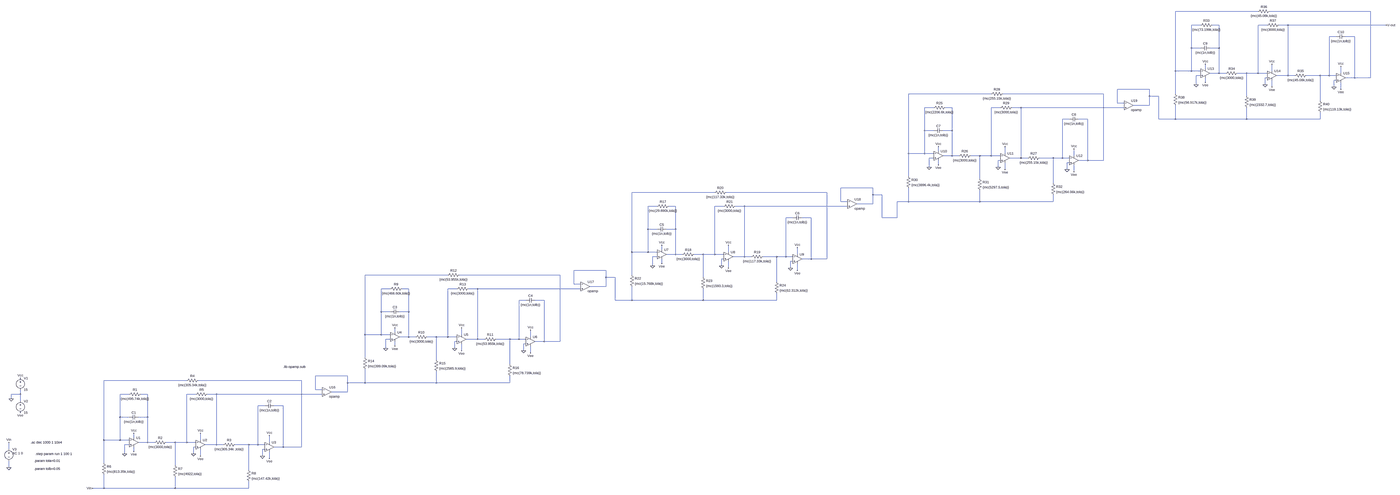
[diagram p0: schematic Todas las etapas.asc, whole sheet]
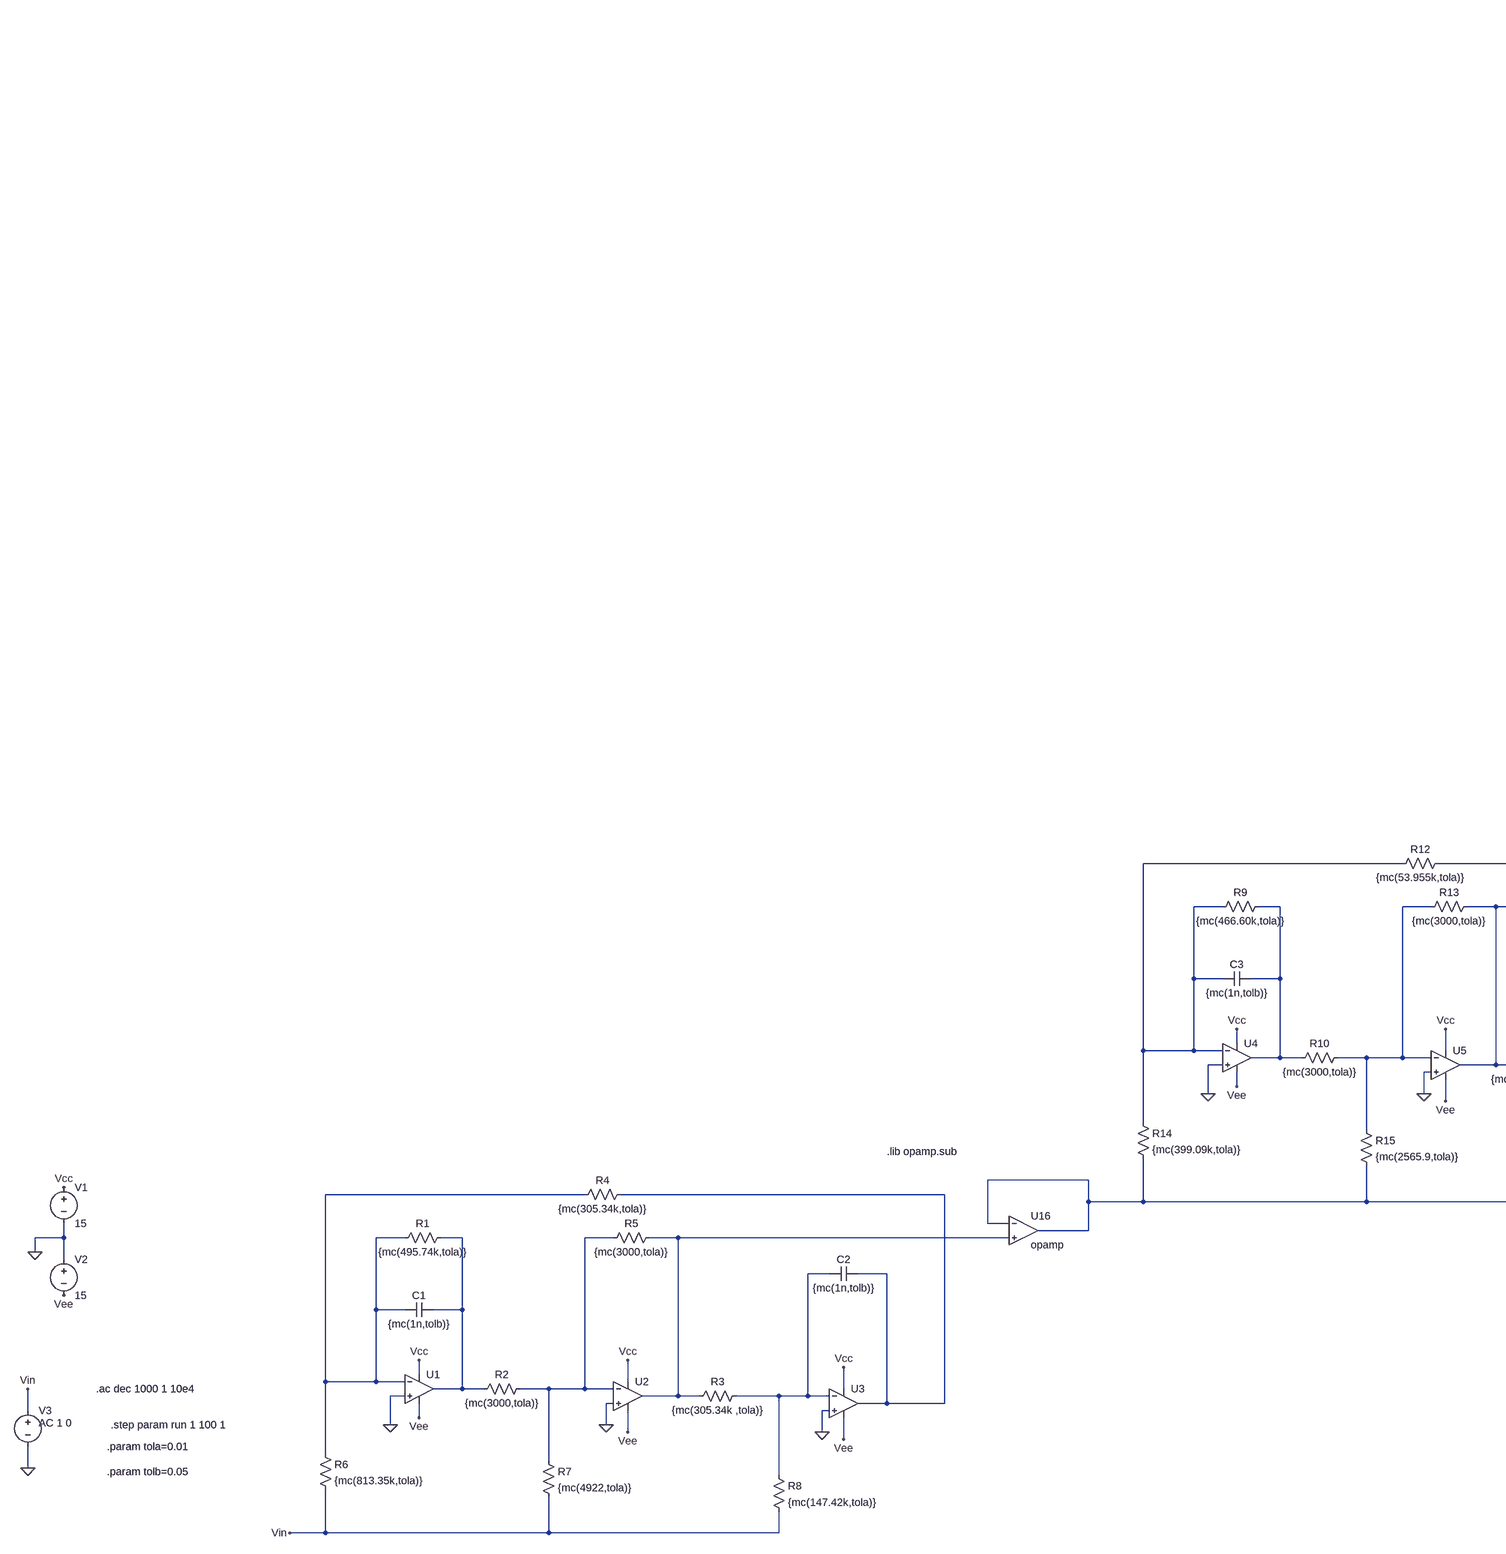
[diagram p1: schematic Todas las etapas.asc, part, row 1 of 1, column 1 of 3]
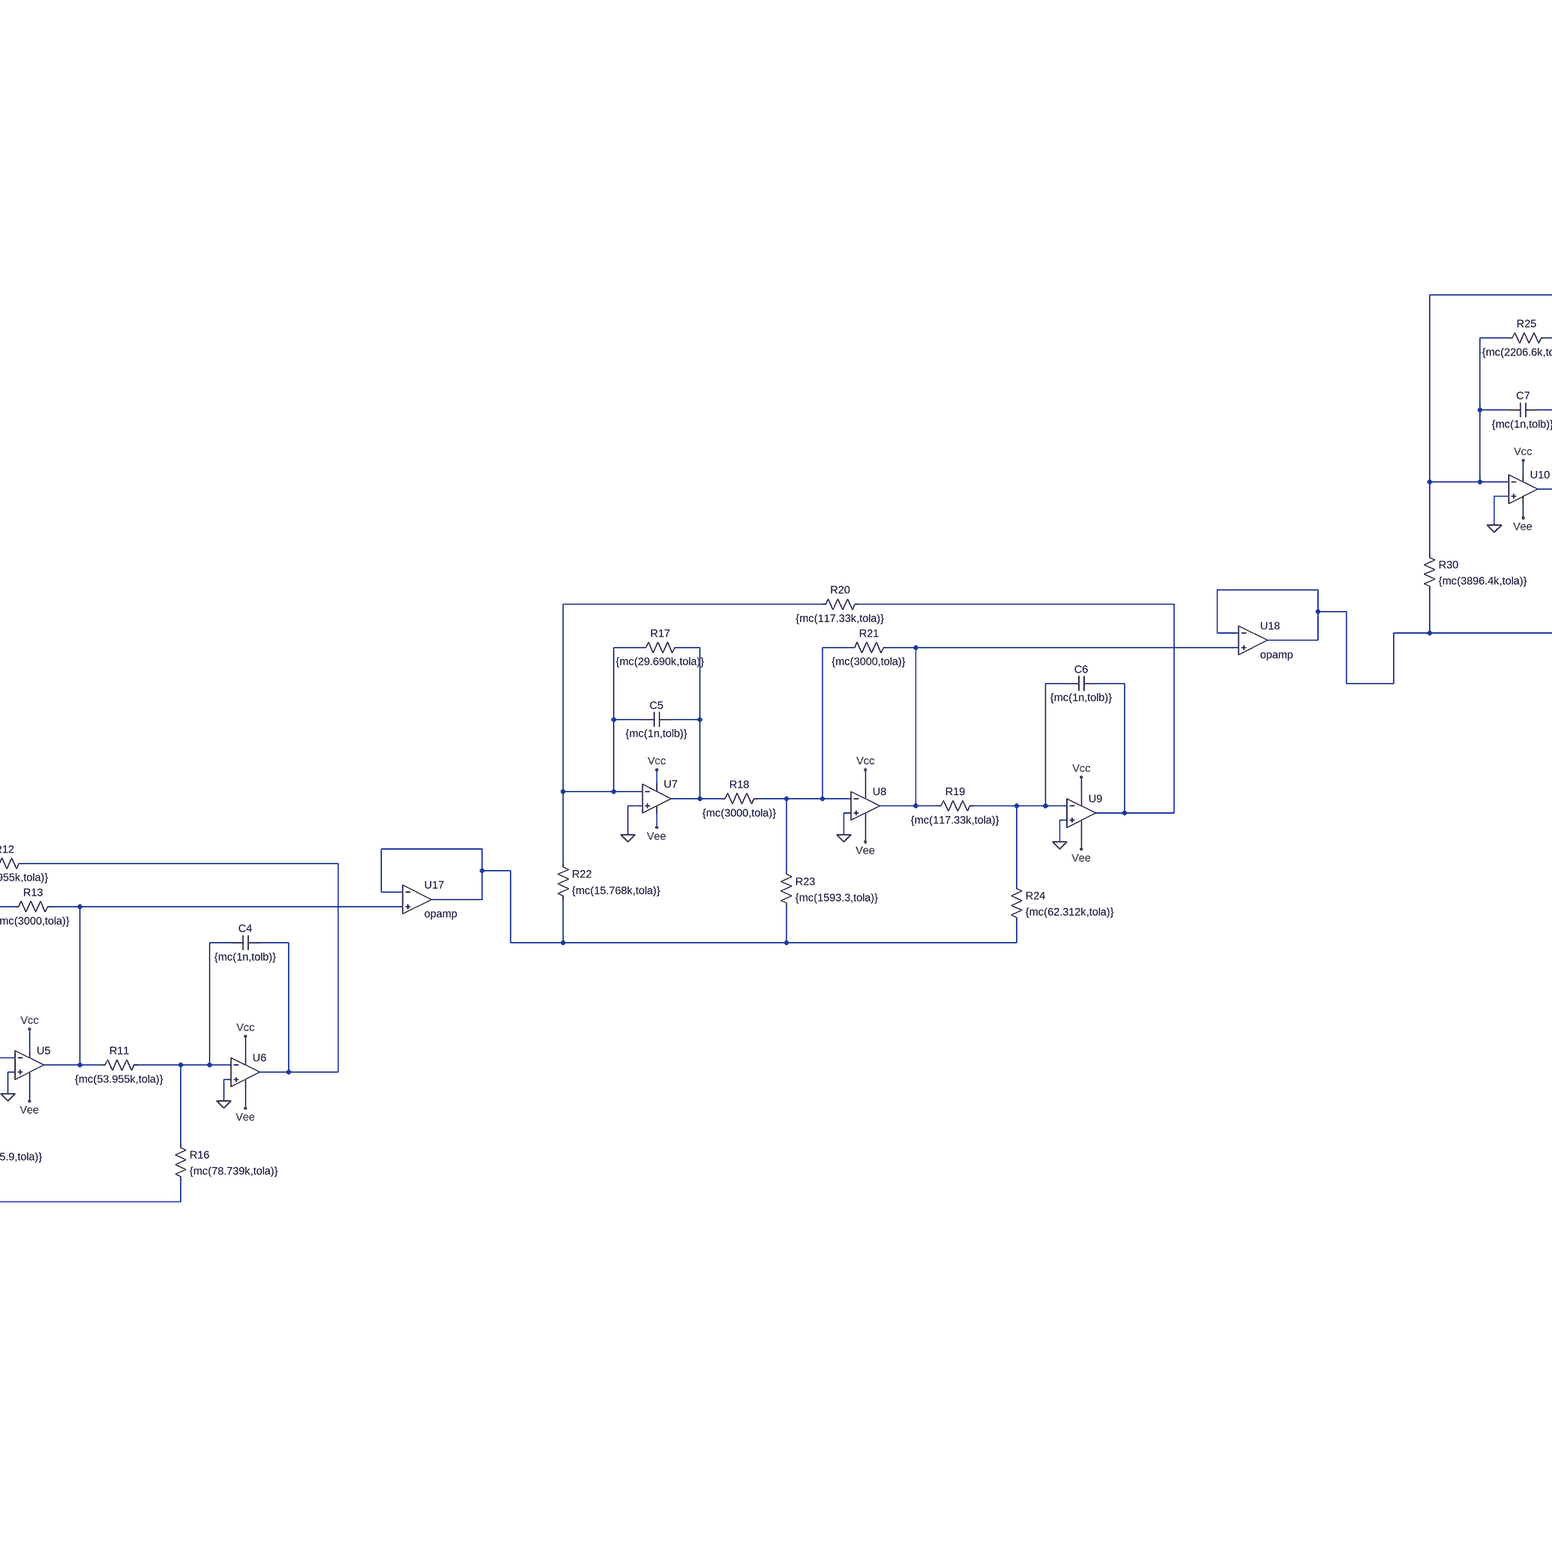
[diagram p2: schematic Todas las etapas.asc, part, row 1 of 1, column 2 of 3]
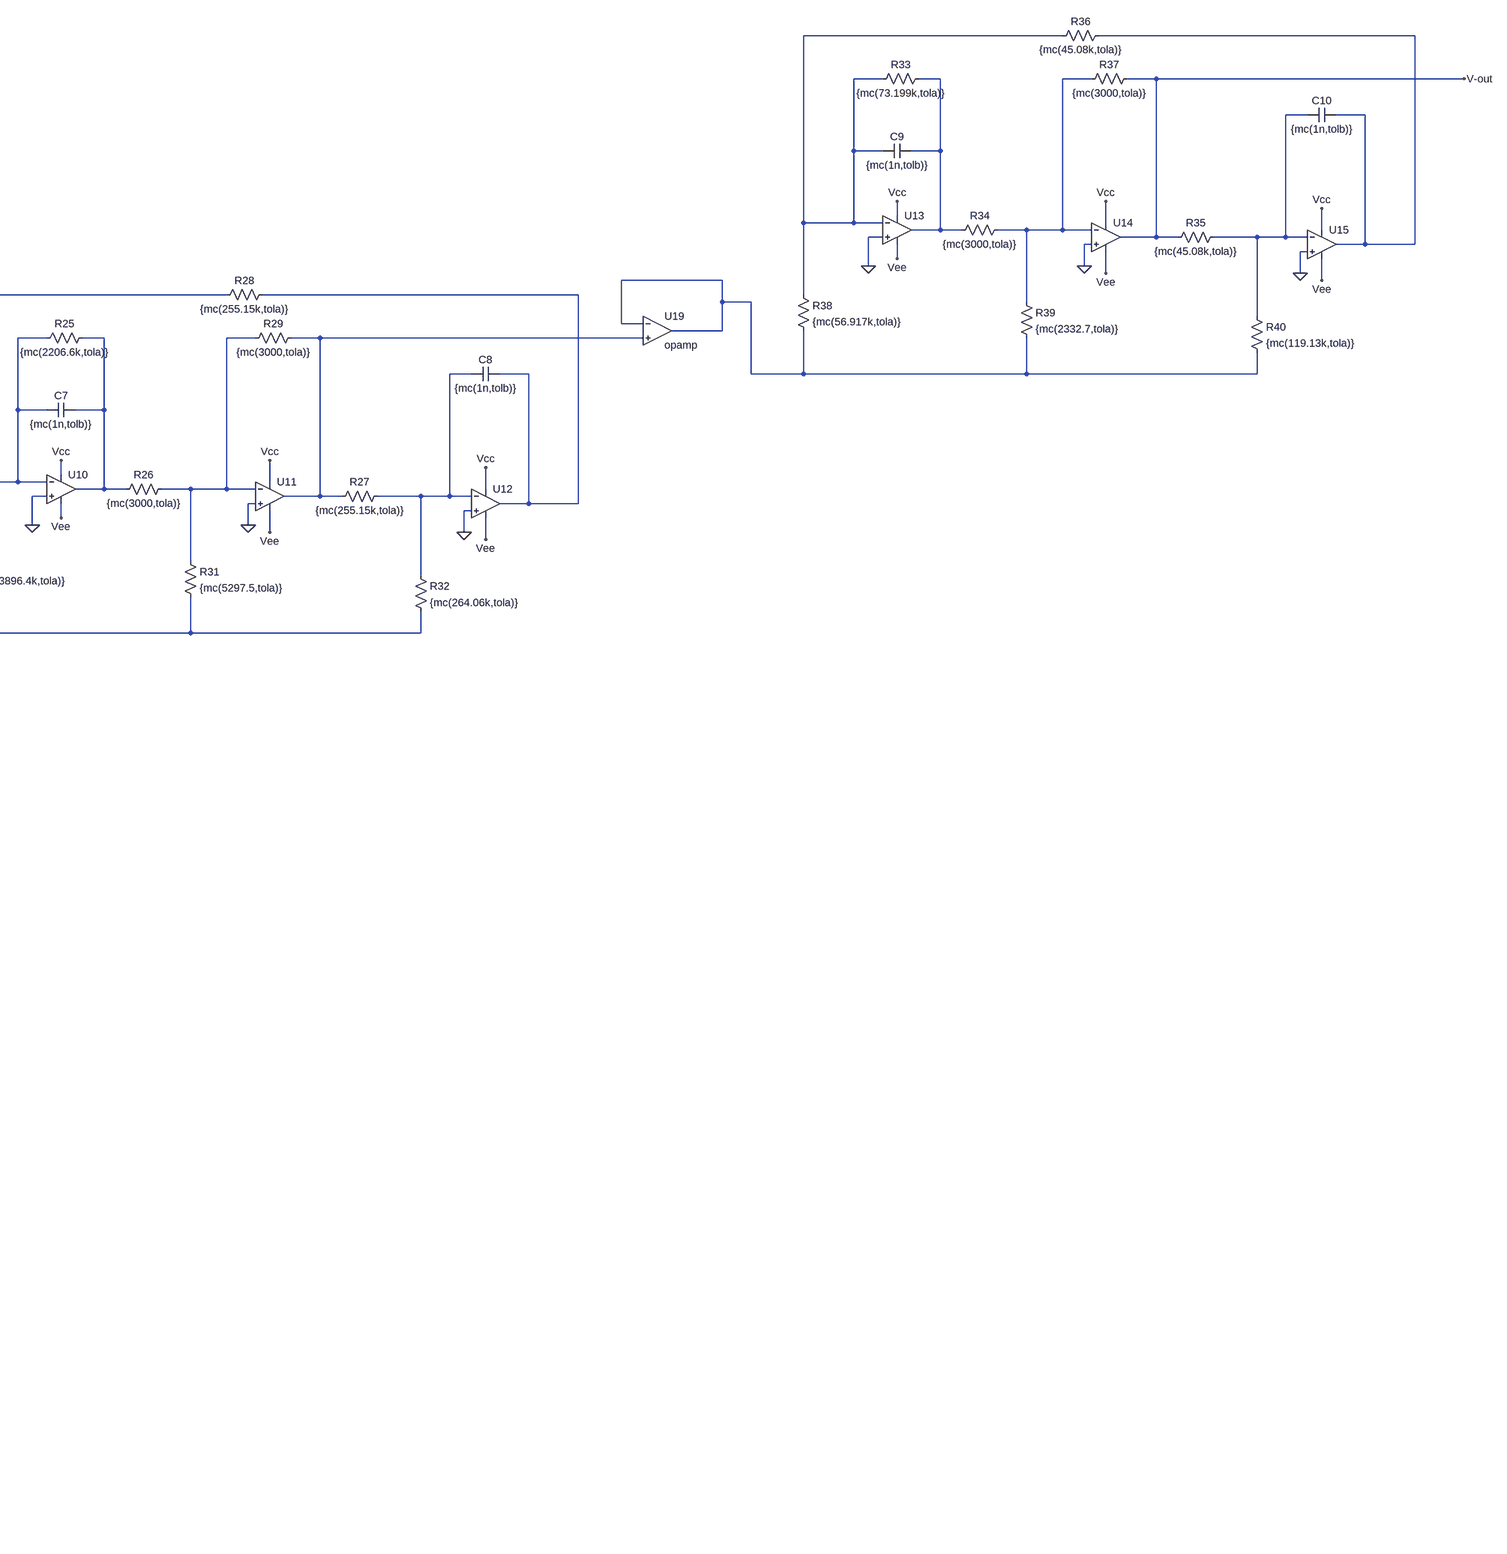
[diagram p3: schematic Todas las etapas.asc, part, row 1 of 1, column 3 of 3]
Todas las etapas.asc, the LTspice schematic file:
Version 4
SHEET 1 10476 1180
WIRE 9456 -2208 8880 -2208
WIRE 10256 -2208 9536 -2208
WIRE 9056 -2112 8992 -2112
WIRE 9184 -2112 9136 -2112
WIRE 9520 -2112 9456 -2112
WIRE 9664 -2112 9600 -2112
WIRE 10400 -2112 9664 -2112
WIRE 10000 -2032 9952 -2032
WIRE 10128 -2032 10064 -2032
WIRE 8992 -1952 8992 -2112
WIRE 9056 -1952 8992 -1952
WIRE 9184 -1952 9184 -2112
WIRE 9184 -1952 9120 -1952
WIRE 9088 -1808 9088 -1840
WIRE 8880 -1792 8880 -2208
WIRE 8992 -1792 8992 -1952
WIRE 8992 -1792 8880 -1792
WIRE 9056 -1792 8992 -1792
WIRE 9552 -1792 9552 -1840
WIRE 9184 -1776 9184 -1952
WIRE 9184 -1776 9120 -1776
WIRE 9232 -1776 9184 -1776
WIRE 9376 -1776 9312 -1776
WIRE 9456 -1776 9456 -2112
WIRE 9456 -1776 9376 -1776
WIRE 9520 -1776 9456 -1776
WIRE 10032 -1776 10032 -1824
WIRE 9056 -1760 9024 -1760
WIRE 9664 -1760 9664 -2112
WIRE 9664 -1760 9584 -1760
WIRE 9712 -1760 9664 -1760
WIRE 9888 -1760 9792 -1760
WIRE 9952 -1760 9952 -2032
WIRE 9952 -1760 9888 -1760
WIRE 10000 -1760 9952 -1760
WIRE 9520 -1744 9504 -1744
WIRE 10128 -1744 10128 -2032
WIRE 10128 -1744 10064 -1744
WIRE 10256 -1744 10256 -2208
WIRE 10256 -1744 10128 -1744
WIRE 10000 -1728 9984 -1728
WIRE 9088 -1712 9088 -1744
WIRE 9024 -1696 9024 -1760
WIRE 9504 -1696 9504 -1744
WIRE 9552 -1680 9552 -1728
WIRE 9984 -1680 9984 -1728
WIRE 7984 -1664 7760 -1664
WIRE 10032 -1664 10032 -1712
WIRE 6864 -1632 6288 -1632
WIRE 7664 -1632 6944 -1632
WIRE 8880 -1632 8880 -1792
WIRE 7984 -1616 7984 -1664
WIRE 8048 -1616 7984 -1616
WIRE 9376 -1616 9376 -1776
WIRE 9888 -1584 9888 -1760
WIRE 7760 -1568 7760 -1664
WIRE 7808 -1568 7760 -1568
WIRE 7984 -1552 7984 -1616
WIRE 7984 -1552 7872 -1552
WIRE 6464 -1536 6400 -1536
WIRE 6592 -1536 6544 -1536
WIRE 6928 -1536 6864 -1536
WIRE 7072 -1536 7008 -1536
WIRE 7808 -1536 7072 -1536
WIRE 7408 -1456 7360 -1456
WIRE 7536 -1456 7472 -1456
WIRE 8048 -1456 8048 -1616
WIRE 8880 -1456 8880 -1552
WIRE 8880 -1456 8048 -1456
WIRE 9376 -1456 9376 -1536
WIRE 9376 -1456 8880 -1456
WIRE 9888 -1456 9888 -1504
WIRE 9888 -1456 9376 -1456
WIRE 6400 -1376 6400 -1536
WIRE 6464 -1376 6400 -1376
WIRE 6592 -1376 6592 -1536
WIRE 6592 -1376 6528 -1376
WIRE 6496 -1232 6496 -1264
WIRE 6288 -1216 6288 -1632
WIRE 6400 -1216 6400 -1376
WIRE 6400 -1216 6288 -1216
WIRE 6464 -1216 6400 -1216
WIRE 6960 -1216 6960 -1264
WIRE 6592 -1200 6592 -1376
WIRE 6592 -1200 6528 -1200
WIRE 6640 -1200 6592 -1200
WIRE 6784 -1200 6720 -1200
WIRE 6864 -1200 6864 -1536
WIRE 6864 -1200 6784 -1200
WIRE 6928 -1200 6864 -1200
WIRE 7440 -1200 7440 -1248
WIRE 6464 -1184 6432 -1184
WIRE 7072 -1184 7072 -1536
WIRE 7072 -1184 6992 -1184
WIRE 7120 -1184 7072 -1184
WIRE 7296 -1184 7200 -1184
WIRE 7360 -1184 7360 -1456
WIRE 7360 -1184 7296 -1184
WIRE 7408 -1184 7360 -1184
WIRE 6928 -1168 6912 -1168
WIRE 7536 -1168 7536 -1456
WIRE 7536 -1168 7472 -1168
WIRE 7664 -1168 7664 -1632
WIRE 7664 -1168 7536 -1168
WIRE 7408 -1152 7392 -1152
WIRE 6496 -1136 6496 -1168
WIRE 6432 -1120 6432 -1184
WIRE 6912 -1120 6912 -1168
WIRE 6960 -1104 6960 -1152
WIRE 7392 -1104 7392 -1152
WIRE 7440 -1088 7440 -1136
WIRE 6288 -1056 6288 -1216
WIRE 6784 -1040 6784 -1200
WIRE 7296 -1008 7296 -1184
WIRE 5488 -976 5264 -976
WIRE 4368 -944 3792 -944
WIRE 5168 -944 4448 -944
WIRE 5488 -928 5488 -976
WIRE 5552 -928 5488 -928
WIRE 5264 -880 5264 -976
WIRE 5312 -880 5264 -880
WIRE 6288 -880 6288 -976
WIRE 6288 -880 6208 -880
WIRE 6784 -880 6784 -960
WIRE 6784 -880 6288 -880
WIRE 7296 -880 7296 -928
WIRE 7296 -880 6784 -880
WIRE 5488 -864 5488 -928
WIRE 5488 -864 5376 -864
WIRE 3968 -848 3904 -848
WIRE 4096 -848 4048 -848
WIRE 4432 -848 4368 -848
WIRE 4576 -848 4512 -848
WIRE 5312 -848 4576 -848
WIRE 4912 -768 4864 -768
WIRE 5040 -768 4976 -768
WIRE 5552 -768 5552 -928
WIRE 6208 -768 6208 -880
WIRE 6208 -768 5552 -768
WIRE 3904 -688 3904 -848
WIRE 3968 -688 3904 -688
WIRE 4096 -688 4096 -848
WIRE 4096 -688 4032 -688
WIRE 4000 -544 4000 -576
WIRE 3792 -528 3792 -944
WIRE 3904 -528 3904 -688
WIRE 3904 -528 3792 -528
WIRE 3968 -528 3904 -528
WIRE 4464 -528 4464 -576
WIRE 4096 -512 4096 -688
WIRE 4096 -512 4032 -512
WIRE 4144 -512 4096 -512
WIRE 4288 -512 4224 -512
WIRE 4368 -512 4368 -848
WIRE 4368 -512 4288 -512
WIRE 4432 -512 4368 -512
WIRE 4944 -512 4944 -560
WIRE 3968 -496 3936 -496
WIRE 4576 -496 4576 -848
WIRE 4576 -496 4496 -496
WIRE 4624 -496 4576 -496
WIRE 4800 -496 4704 -496
WIRE 4864 -496 4864 -768
WIRE 4864 -496 4800 -496
WIRE 4912 -496 4864 -496
WIRE 4432 -480 4416 -480
WIRE 5040 -480 5040 -768
WIRE 5040 -480 4976 -480
WIRE 5168 -480 5168 -944
WIRE 5168 -480 5040 -480
WIRE 4912 -464 4896 -464
WIRE 4000 -448 4000 -480
WIRE 3936 -432 3936 -496
WIRE 4416 -432 4416 -480
WIRE 4464 -416 4464 -464
WIRE 4896 -416 4896 -464
WIRE 2848 -400 2624 -400
WIRE 4944 -400 4944 -448
WIRE 1728 -368 1152 -368
WIRE 2528 -368 1808 -368
WIRE 3792 -368 3792 -528
WIRE 2848 -352 2848 -400
WIRE 2912 -352 2848 -352
WIRE 4288 -352 4288 -512
WIRE 4800 -320 4800 -496
WIRE 2624 -304 2624 -400
WIRE 2672 -304 2624 -304
WIRE 2848 -288 2848 -352
WIRE 2848 -288 2736 -288
WIRE 1328 -272 1264 -272
WIRE 1456 -272 1408 -272
WIRE 1792 -272 1728 -272
WIRE 1936 -272 1872 -272
WIRE 2672 -272 1936 -272
WIRE 2272 -192 2224 -192
WIRE 2400 -192 2336 -192
WIRE 2912 -192 2912 -352
WIRE 3792 -192 3792 -288
WIRE 3792 -192 2912 -192
WIRE 4288 -192 4288 -272
WIRE 4288 -192 3792 -192
WIRE 4800 -192 4800 -240
WIRE 4800 -192 4288 -192
WIRE 1264 -112 1264 -272
WIRE 1328 -112 1264 -112
WIRE 1456 -112 1456 -272
WIRE 1456 -112 1392 -112
WIRE 1360 32 1360 0
WIRE 1152 48 1152 -368
WIRE 1264 48 1264 -112
WIRE 1264 48 1152 48
WIRE 1328 48 1264 48
WIRE 1824 48 1824 0
WIRE 1456 64 1456 -112
WIRE 1456 64 1392 64
WIRE 1504 64 1456 64
WIRE 1648 64 1584 64
WIRE 1728 64 1728 -272
WIRE 1728 64 1648 64
WIRE 1792 64 1728 64
WIRE 2304 64 2304 16
WIRE 1328 80 1296 80
WIRE 1936 80 1936 -272
WIRE 1936 80 1856 80
WIRE 1984 80 1936 80
WIRE 2160 80 2064 80
WIRE 2224 80 2224 -192
WIRE 2224 80 2160 80
WIRE 2272 80 2224 80
WIRE 1792 96 1776 96
WIRE 2400 96 2400 -192
WIRE 2400 96 2336 96
WIRE 2528 96 2528 -368
WIRE 2528 96 2400 96
WIRE 2272 112 2256 112
WIRE 1360 128 1360 96
WIRE 1296 144 1296 80
WIRE 1776 144 1776 96
WIRE 1824 160 1824 112
WIRE 2256 160 2256 112
WIRE 2304 176 2304 128
WIRE 1152 208 1152 48
WIRE 1648 224 1648 64
WIRE 2160 256 2160 80
WIRE 528 336 304 336
WIRE -592 368 -1168 368
WIRE 208 368 -512 368
WIRE 528 384 528 336
WIRE 1152 384 1152 288
WIRE 1152 384 528 384
WIRE 1648 384 1648 304
WIRE 1648 384 1152 384
WIRE 2160 384 2160 336
WIRE 2160 384 1648 384
WIRE 304 432 304 336
WIRE 352 432 304 432
WIRE 528 448 528 384
WIRE 528 448 416 448
WIRE -1840 464 -1840 432
WIRE -1840 464 -1904 464
WIRE -992 464 -1056 464
WIRE -864 464 -912 464
WIRE -528 464 -592 464
WIRE -384 464 -448 464
WIRE 352 464 -384 464
WIRE -1904 496 -1904 464
WIRE -1840 512 -1840 464
WIRE -48 544 -96 544
WIRE 80 544 16 544
WIRE -1056 624 -1056 464
WIRE -992 624 -1056 624
WIRE -864 624 -864 464
WIRE -864 624 -928 624
WIRE -960 768 -960 736
WIRE -1168 784 -1168 368
WIRE -1056 784 -1056 624
WIRE -1056 784 -1168 784
WIRE -992 784 -1056 784
WIRE -496 784 -496 736
WIRE -864 800 -864 624
WIRE -864 800 -928 800
WIRE -816 800 -864 800
WIRE -672 800 -736 800
WIRE -592 800 -592 464
WIRE -592 800 -672 800
WIRE -528 800 -592 800
WIRE -16 800 -16 752
WIRE -992 816 -1024 816
WIRE -384 816 -384 464
WIRE -384 816 -464 816
WIRE -336 816 -384 816
WIRE -160 816 -256 816
WIRE -96 816 -96 544
WIRE -96 816 -160 816
WIRE -48 816 -96 816
WIRE -528 832 -544 832
WIRE 80 832 80 544
WIRE 80 832 16 832
WIRE 208 832 208 368
WIRE 208 832 80 832
WIRE -1920 848 -1920 800
WIRE -48 848 -64 848
WIRE -960 864 -960 832
WIRE -1024 880 -1024 816
WIRE -544 880 -544 832
WIRE -496 896 -496 848
WIRE -64 896 -64 848
WIRE -16 912 -16 864
WIRE -1168 944 -1168 784
WIRE -672 960 -672 800
WIRE -1920 976 -1920 928
WIRE -160 992 -160 816
WIRE -1168 1120 -1168 1024
WIRE -1168 1120 -1248 1120
WIRE -672 1120 -672 1040
WIRE -672 1120 -1168 1120
WIRE -160 1120 -160 1072
WIRE -160 1120 -672 1120
FLAG -1840 352 Vcc
FLAG -1840 592 Vee
FLAG -1904 496 0
FLAG -1920 976 0
FLAG -1920 800 Vin
FLAG -64 896 0
FLAG -544 880 0
FLAG -960 736 Vcc
FLAG -496 736 Vcc
FLAG -16 752 Vcc
FLAG -960 864 Vee
FLAG -496 896 Vee
FLAG -16 912 Vee
FLAG -1024 880 0
FLAG -1248 1120 Vin
FLAG 2256 160 0
FLAG 1776 144 0
FLAG 1360 0 Vcc
FLAG 1824 0 Vcc
FLAG 2304 16 Vcc
FLAG 1360 128 Vee
FLAG 1824 160 Vee
FLAG 2304 176 Vee
FLAG 1296 144 0
FLAG 4896 -416 0
FLAG 4416 -432 0
FLAG 4000 -576 Vcc
FLAG 4464 -576 Vcc
FLAG 4944 -560 Vcc
FLAG 4000 -448 Vee
FLAG 4464 -416 Vee
FLAG 4944 -400 Vee
FLAG 3936 -432 0
FLAG 7392 -1104 0
FLAG 6912 -1120 0
FLAG 6496 -1264 Vcc
FLAG 6960 -1264 Vcc
FLAG 7440 -1248 Vcc
FLAG 6496 -1136 Vee
FLAG 6960 -1104 Vee
FLAG 7440 -1088 Vee
FLAG 6432 -1120 0
FLAG 9984 -1680 0
FLAG 9504 -1696 0
FLAG 10400 -2112 V-out
FLAG 9088 -1840 Vcc
FLAG 9552 -1840 Vcc
FLAG 10032 -1824 Vcc
FLAG 9088 -1712 Vee
FLAG 9552 -1680 Vee
FLAG 10032 -1664 Vee
FLAG 9024 -1696 0
SYMBOL voltage -1840 336 R0
WINDOW 123 0 0 Left 2
WINDOW 39 0 0 Left 2
SYMATTR InstName V1
SYMATTR Value 15
SYMBOL voltage -1840 496 R0
WINDOW 123 0 0 Left 2
WINDOW 39 0 0 Left 2
SYMATTR InstName V2
SYMATTR Value 15
SYMBOL voltage -1920 832 R0
WINDOW 123 24 44 Left 2
WINDOW 39 0 0 Left 2
SYMATTR Value2 AC 1 0
SYMATTR InstName V3
SYMATTR Value ""
SYMBOL Opamps\\UniversalOpamp2 -960 800 R0
SYMATTR InstName U1
SYMATTR Value2 Avol=1000Meg GBW=10000Meg Slew=1000Meg
SYMATTR SpiceLine ilimit=50 rail=0 Vos=0 phimargin=45
SYMATTR SpiceLine2 en=0 enk=0 in=0 ink=0 Rin=100000Meg
SYMBOL Opamps\\UniversalOpamp2 -496 816 R0
SYMATTR InstName U2
SYMATTR Value2 Avol=1000Meg GBW=10000Meg Slew=1000Meg
SYMATTR SpiceLine ilimit=50 rail=0 Vos=0 phimargin=45
SYMATTR SpiceLine2 en=0 enk=0 in=0 ink=0 Rin=100000Meg
SYMBOL Opamps\\UniversalOpamp2 -16 832 R0
SYMATTR InstName U3
SYMATTR Value2 Avol=1000Meg GBW=10000Meg Slew=1000Meg
SYMATTR SpiceLine ilimit=50 rail=0 Vos=0 phimargin=45
SYMATTR SpiceLine2 en=0 enk=0 in=0 ink=0 Rin=100000Meg
SYMBOL res -896 448 R90
WINDOW 0 0 56 VBottom 2
WINDOW 3 32 56 VTop 2
SYMATTR InstName R1
SYMATTR Value {mc(495.74k,tola)}
SYMBOL res -720 784 R90
WINDOW 0 0 56 VBottom 2
WINDOW 3 32 56 VTop 2
SYMATTR InstName R2
SYMATTR Value {mc(3000,tola)}
SYMBOL res -240 800 R90
WINDOW 0 0 56 VBottom 2
WINDOW 3 32 56 VTop 2
SYMATTR InstName R3
SYMATTR Value {mc(305.34k ,tola)}
SYMBOL cap -928 608 R90
WINDOW 0 0 32 VBottom 2
WINDOW 3 32 32 VTop 2
SYMATTR InstName C1
SYMATTR Value {mc(1n,tolb)}
SYMBOL res -496 352 R90
WINDOW 0 0 56 VBottom 2
WINDOW 3 32 56 VTop 2
SYMATTR InstName R4
SYMATTR Value {mc(305.34k,tola)}
SYMBOL res -432 448 R90
WINDOW 0 0 56 VBottom 2
WINDOW 3 32 56 VTop 2
SYMATTR InstName R5
SYMATTR Value {mc(3000,tola)}
SYMBOL cap 16 528 R90
WINDOW 0 0 32 VBottom 2
WINDOW 3 32 32 VTop 2
SYMATTR InstName C2
SYMATTR Value {mc(1n,tolb)}
SYMBOL res -1184 928 R0
SYMATTR InstName R6
SYMATTR Value {mc(813.35k,tola)}
SYMBOL res -688 944 R0
SYMATTR InstName R7
SYMATTR Value {mc(4922,tola)}
SYMBOL res -176 976 R0
SYMATTR InstName R8
SYMATTR Value {mc(147.42k,tola)}
SYMBOL Opamps\\UniversalOpamp2 1360 64 R0
SYMATTR InstName U4
SYMATTR Value2 Avol=1000Meg GBW=10000Meg Slew=1000Meg
SYMATTR SpiceLine ilimit=50 rail=0 Vos=0 phimargin=45
SYMATTR SpiceLine2 en=0 enk=0 in=0 ink=0 Rin=100000Meg
SYMBOL Opamps\\UniversalOpamp2 1824 80 R0
SYMATTR InstName U5
SYMATTR Value2 Avol=1000Meg GBW=10000Meg Slew=1000Meg
SYMATTR SpiceLine ilimit=50 rail=0 Vos=0 phimargin=45
SYMATTR SpiceLine2 en=0 enk=0 in=0 ink=0 Rin=100000Meg
SYMBOL Opamps\\UniversalOpamp2 2304 96 R0
SYMATTR InstName U6
SYMATTR Value2 Avol=1000Meg GBW=10000Meg Slew=1000Meg
SYMATTR SpiceLine ilimit=50 rail=0 Vos=0 phimargin=45
SYMATTR SpiceLine2 en=0 enk=0 in=0 ink=0 Rin=100000Meg
SYMBOL res 1424 -288 R90
WINDOW 0 0 56 VBottom 2
WINDOW 3 32 56 VTop 2
SYMATTR InstName R9
SYMATTR Value {mc(466.60k,tola)}
SYMBOL res 1600 48 R90
WINDOW 0 0 56 VBottom 2
WINDOW 3 32 56 VTop 2
SYMATTR InstName R10
SYMATTR Value {mc(3000,tola)}
SYMBOL res 2080 64 R90
WINDOW 0 0 56 VBottom 2
WINDOW 3 32 56 VTop 2
SYMATTR InstName R11
SYMATTR Value {mc(53.955k,tola)}
SYMBOL cap 1392 -128 R90
WINDOW 0 0 32 VBottom 2
WINDOW 3 32 32 VTop 2
SYMATTR InstName C3
SYMATTR Value {mc(1n,tolb)}
SYMBOL res 1824 -384 R90
WINDOW 0 0 56 VBottom 2
WINDOW 3 32 56 VTop 2
SYMATTR InstName R12
SYMATTR Value {mc(53.955k,tola)}
SYMBOL res 1888 -288 R90
WINDOW 0 0 56 VBottom 2
WINDOW 3 32 56 VTop 2
SYMATTR InstName R13
SYMATTR Value {mc(3000,tola)}
SYMBOL cap 2336 -208 R90
WINDOW 0 0 32 VBottom 2
WINDOW 3 32 32 VTop 2
SYMATTR InstName C4
SYMATTR Value {mc(1n,tolb)}
SYMBOL res 1136 192 R0
SYMATTR InstName R14
SYMATTR Value {mc(399.09k,tola)}
SYMBOL res 1632 208 R0
SYMATTR InstName R15
SYMATTR Value {mc(2565.9,tola)}
SYMBOL res 2144 240 R0
SYMATTR InstName R16
SYMATTR Value {mc(78.739k,tola)}
SYMBOL Opamps\\UniversalOpamp2 4000 -512 R0
SYMATTR InstName U7
SYMATTR Value2 Avol=1000Meg GBW=10000Meg Slew=1000Meg
SYMATTR SpiceLine ilimit=50 rail=0 Vos=0 phimargin=45
SYMATTR SpiceLine2 en=0 enk=0 in=0 ink=0 Rin=100000Meg
SYMBOL Opamps\\UniversalOpamp2 4464 -496 R0
SYMATTR InstName U8
SYMATTR Value2 Avol=1000Meg GBW=10000Meg Slew=1000Meg
SYMATTR SpiceLine ilimit=50 rail=0 Vos=0 phimargin=45
SYMATTR SpiceLine2 en=0 enk=0 in=0 ink=0 Rin=100000Meg
SYMBOL Opamps\\UniversalOpamp2 4944 -480 R0
SYMATTR InstName U9
SYMATTR Value2 Avol=1000Meg GBW=10000Meg Slew=1000Meg
SYMATTR SpiceLine ilimit=50 rail=0 Vos=0 phimargin=45
SYMATTR SpiceLine2 en=0 enk=0 in=0 ink=0 Rin=100000Meg
SYMBOL res 4064 -864 R90
WINDOW 0 0 56 VBottom 2
WINDOW 3 32 56 VTop 2
SYMATTR InstName R17
SYMATTR Value {mc(29.690k,tola)}
SYMBOL res 4240 -528 R90
WINDOW 0 0 56 VBottom 2
WINDOW 3 32 56 VTop 2
SYMATTR InstName R18
SYMATTR Value {mc(3000,tola)}
SYMBOL res 4720 -512 R90
WINDOW 0 0 56 VBottom 2
WINDOW 3 32 56 VTop 2
SYMATTR InstName R19
SYMATTR Value {mc(117.33k,tola)}
SYMBOL cap 4032 -704 R90
WINDOW 0 0 32 VBottom 2
WINDOW 3 32 32 VTop 2
SYMATTR InstName C5
SYMATTR Value {mc(1n,tolb)}
SYMBOL res 4464 -960 R90
WINDOW 0 0 56 VBottom 2
WINDOW 3 32 56 VTop 2
SYMATTR InstName R20
SYMATTR Value {mc(117.33k,tola)}
SYMBOL res 4528 -864 R90
WINDOW 0 0 56 VBottom 2
WINDOW 3 32 56 VTop 2
SYMATTR InstName R21
SYMATTR Value {mc(3000,tola)}
SYMBOL cap 4976 -784 R90
WINDOW 0 0 32 VBottom 2
WINDOW 3 32 32 VTop 2
SYMATTR InstName C6
SYMATTR Value {mc(1n,tolb)}
SYMBOL res 3776 -384 R0
SYMATTR InstName R22
SYMATTR Value {mc(15.768k,tola)}
SYMBOL res 4272 -368 R0
SYMATTR InstName R23
SYMATTR Value {mc(1593.3,tola)}
SYMBOL res 4784 -336 R0
SYMATTR InstName R24
SYMATTR Value {mc(62.312k,tola)}
SYMBOL Opamps\\UniversalOpamp2 6496 -1200 R0
SYMATTR InstName U10
SYMATTR Value2 Avol=1000Meg GBW=10000Meg Slew=1000Meg
SYMATTR SpiceLine ilimit=50 rail=0 Vos=0 phimargin=45
SYMATTR SpiceLine2 en=0 enk=0 in=0 ink=0 Rin=100000Meg
SYMBOL Opamps\\UniversalOpamp2 6960 -1184 R0
SYMATTR InstName U11
SYMATTR Value2 Avol=1000Meg GBW=10000Meg Slew=1000Meg
SYMATTR SpiceLine ilimit=50 rail=0 Vos=0 phimargin=45
SYMATTR SpiceLine2 en=0 enk=0 in=0 ink=0 Rin=100000Meg
SYMBOL Opamps\\UniversalOpamp2 7440 -1168 R0
SYMATTR InstName U12
SYMATTR Value2 Avol=1000Meg GBW=10000Meg Slew=1000Meg
SYMATTR SpiceLine ilimit=50 rail=0 Vos=0 phimargin=45
SYMATTR SpiceLine2 en=0 enk=0 in=0 ink=0 Rin=100000Meg
SYMBOL res 6560 -1552 R90
WINDOW 0 0 56 VBottom 2
WINDOW 3 32 56 VTop 2
SYMATTR InstName R25
SYMATTR Value {mc(2206.6k,tola)}
SYMBOL res 6736 -1216 R90
WINDOW 0 0 56 VBottom 2
WINDOW 3 32 56 VTop 2
SYMATTR InstName R26
SYMATTR Value {mc(3000,tola)}
SYMBOL res 7216 -1200 R90
WINDOW 0 0 56 VBottom 2
WINDOW 3 32 56 VTop 2
SYMATTR InstName R27
SYMATTR Value {mc(255.15k,tola)}
SYMBOL cap 6528 -1392 R90
WINDOW 0 0 32 VBottom 2
WINDOW 3 32 32 VTop 2
SYMATTR InstName C7
SYMATTR Value {mc(1n,tolb)}
SYMBOL res 6960 -1648 R90
WINDOW 0 0 56 VBottom 2
WINDOW 3 32 56 VTop 2
SYMATTR InstName R28
SYMATTR Value {mc(255.15k,tola)}
SYMBOL res 7024 -1552 R90
WINDOW 0 0 56 VBottom 2
WINDOW 3 32 56 VTop 2
SYMATTR InstName R29
SYMATTR Value {mc(3000,tola)}
SYMBOL cap 7472 -1472 R90
WINDOW 0 0 32 VBottom 2
WINDOW 3 32 32 VTop 2
SYMATTR InstName C8
SYMATTR Value {mc(1n,tolb)}
SYMBOL res 6272 -1072 R0
SYMATTR InstName R30
SYMATTR Value {mc(3896.4k,tola)}
SYMBOL res 6768 -1056 R0
SYMATTR InstName R31
SYMATTR Value {mc(5297.5,tola)}
SYMBOL res 7280 -1024 R0
SYMATTR InstName R32
SYMATTR Value {mc(264.06k,tola)}
SYMBOL Opamps\\UniversalOpamp2 9088 -1776 R0
SYMATTR InstName U13
SYMATTR Value2 Avol=1000Meg GBW=10000Meg Slew=1000Meg
SYMATTR SpiceLine ilimit=50 rail=0 Vos=0 phimargin=45
SYMATTR SpiceLine2 en=0 enk=0 in=0 ink=0 Rin=100000Meg
SYMBOL Opamps\\UniversalOpamp2 9552 -1760 R0
SYMATTR InstName U14
SYMATTR Value2 Avol=1000Meg GBW=10000Meg Slew=1000Meg
SYMATTR SpiceLine ilimit=50 rail=0 Vos=0 phimargin=45
SYMATTR SpiceLine2 en=0 enk=0 in=0 ink=0 Rin=100000Meg
SYMBOL Opamps\\UniversalOpamp2 10032 -1744 R0
SYMATTR InstName U15
SYMATTR Value2 Avol=1000Meg GBW=10000Meg Slew=1000Meg
SYMATTR SpiceLine ilimit=50 rail=0 Vos=0 phimargin=45
SYMATTR SpiceLine2 en=0 enk=0 in=0 ink=0 Rin=100000Meg
SYMBOL res 9152 -2128 R90
WINDOW 0 0 56 VBottom 2
WINDOW 3 32 56 VTop 2
SYMATTR InstName R33
SYMATTR Value {mc(73.199k,tola)}
SYMBOL res 9328 -1792 R90
WINDOW 0 0 56 VBottom 2
WINDOW 3 32 56 VTop 2
SYMATTR InstName R34
SYMATTR Value {mc(3000,tola)}
SYMBOL res 9808 -1776 R90
WINDOW 0 0 56 VBottom 2
WINDOW 3 32 56 VTop 2
SYMATTR InstName R35
SYMATTR Value {mc(45.08k,tola)}
SYMBOL cap 9120 -1968 R90
WINDOW 0 0 32 VBottom 2
WINDOW 3 32 32 VTop 2
SYMATTR InstName C9
SYMATTR Value {mc(1n,tolb)}
SYMBOL res 9552 -2224 R90
WINDOW 0 0 56 VBottom 2
WINDOW 3 32 56 VTop 2
SYMATTR InstName R36
SYMATTR Value {mc(45.08k,tola)}
SYMBOL res 9616 -2128 R90
WINDOW 0 0 56 VBottom 2
WINDOW 3 32 56 VTop 2
SYMATTR InstName R37
SYMATTR Value {mc(3000,tola)}
SYMBOL cap 10064 -2048 R90
WINDOW 0 0 32 VBottom 2
WINDOW 3 32 32 VTop 2
SYMATTR InstName C10
SYMATTR Value {mc(1n,tolb)}
SYMBOL res 8864 -1648 R0
SYMATTR InstName R38
SYMATTR Value {mc(56.917k,tola)}
SYMBOL res 9360 -1632 R0
SYMATTR InstName R39
SYMATTR Value {mc(2332.7,tola)}
SYMBOL res 9872 -1600 R0
SYMATTR InstName R40
SYMATTR Value {mc(119.13k,tola)}
SYMBOL Opamps\\opamp 384 384 R0
SYMATTR InstName U16
SYMBOL Opamps\\opamp 2704 -352 R0
SYMATTR InstName U17
SYMBOL Opamps\\opamp 5344 -928 R0
SYMATTR InstName U18
SYMBOL Opamps\\opamp 7840 -1616 R0
SYMATTR InstName U19
TEXT -1768 800 Left 2 !.ac dec 1000 1 10e4
TEXT -1736 880 Left 2 !.step param run 1 100 1
TEXT -1744 928 Left 2 !.param tola=0.01
TEXT -1744 984 Left 2 !.param tolb=0.05
TEXT 80 272 Left 2 !.lib opamp.sub

The netlist it stands for:
* Todas las etapas.asc
V1 Vcc 0 15
V2 0 Vee 15
V3 Vin 0 AC 1 0
XU1 0 N028 Vcc Vee N030 level.2 Avol=1000Meg GBW=10000Meg Slew=1000Meg ilimit=50 rail=0 Vos=0 phimargin=45 en=0 enk=0 in=0 ink=0 Rin=100000Meg  ; pins IN+ IN- V+ V- OUT
XU2 0 N031 Vcc Vee N032 level.2 Avol=1000Meg GBW=10000Meg Slew=1000Meg ilimit=50 rail=0 Vos=0 phimargin=45 en=0 enk=0 in=0 ink=0 Rin=100000Meg  ; pins IN+ IN- V+ V- OUT
XU3 0 N033 Vcc Vee N029 level.2 Avol=1000Meg GBW=10000Meg Slew=1000Meg ilimit=50 rail=0 Vos=0 phimargin=45 en=0 enk=0 in=0 ink=0 Rin=100000Meg  ; pins IN+ IN- V+ V- OUT
R1 N030 N028 {mc(495.74k,tola)}
R2 N031 N030 {mc(3000,tola)}
R3 N033 N032 {mc(305.34k ,tola)}
C1 N030 N028 {mc(1n,tolb)}
R4 N029 N028 {mc(305.34k,tola)}
R5 N032 N031 {mc(3000,tola)}
C2 N029 N033 {mc(1n,tolb)}
R6 N028 Vin {mc(813.35k,tola)}
R7 N031 Vin {mc(4922,tola)}
R8 N033 Vin {mc(147.42k,tola)}
XU4 0 N021 Vcc Vee N023 level.2 Avol=1000Meg GBW=10000Meg Slew=1000Meg ilimit=50 rail=0 Vos=0 phimargin=45 en=0 enk=0 in=0 ink=0 Rin=100000Meg  ; pins IN+ IN- V+ V- OUT
XU5 0 N024 Vcc Vee N025 level.2 Avol=1000Meg GBW=10000Meg Slew=1000Meg ilimit=50 rail=0 Vos=0 phimargin=45 en=0 enk=0 in=0 ink=0 Rin=100000Meg  ; pins IN+ IN- V+ V- OUT
XU6 0 N026 Vcc Vee N022 level.2 Avol=1000Meg GBW=10000Meg Slew=1000Meg ilimit=50 rail=0 Vos=0 phimargin=45 en=0 enk=0 in=0 ink=0 Rin=100000Meg  ; pins IN+ IN- V+ V- OUT
R9 N023 N021 {mc(466.60k,tola)}
R10 N024 N023 {mc(3000,tola)}
R11 N026 N025 {mc(53.955k,tola)}
C3 N023 N021 {mc(1n,tolb)}
R12 N022 N021 {mc(53.955k,tola)}
R13 N025 N024 {mc(3000,tola)}
C4 N022 N026 {mc(1n,tolb)}
R14 N021 N027 {mc(399.09k,tola)}
R15 N024 N027 {mc(2565.9,tola)}
R16 N026 N027 {mc(78.739k,tola)}
XU7 0 N014 Vcc Vee N016 level.2 Avol=1000Meg GBW=10000Meg Slew=1000Meg ilimit=50 rail=0 Vos=0 phimargin=45 en=0 enk=0 in=0 ink=0 Rin=100000Meg  ; pins IN+ IN- V+ V- OUT
XU8 0 N017 Vcc Vee N018 level.2 Avol=1000Meg GBW=10000Meg Slew=1000Meg ilimit=50 rail=0 Vos=0 phimargin=45 en=0 enk=0 in=0 ink=0 Rin=100000Meg  ; pins IN+ IN- V+ V- OUT
XU9 0 N019 Vcc Vee N015 level.2 Avol=1000Meg GBW=10000Meg Slew=1000Meg ilimit=50 rail=0 Vos=0 phimargin=45 en=0 enk=0 in=0 ink=0 Rin=100000Meg  ; pins IN+ IN- V+ V- OUT
R17 N016 N014 {mc(29.690k,tola)}
R18 N017 N016 {mc(3000,tola)}
R19 N019 N018 {mc(117.33k,tola)}
C5 N016 N014 {mc(1n,tolb)}
R20 N015 N014 {mc(117.33k,tola)}
R21 N018 N017 {mc(3000,tola)}
C6 N015 N019 {mc(1n,tolb)}
R22 N014 N020 {mc(15.768k,tola)}
R23 N017 N020 {mc(1593.3,tola)}
R24 N019 N020 {mc(62.312k,tola)}
XU10 0 N007 Vcc Vee N009 level.2 Avol=1000Meg GBW=10000Meg Slew=1000Meg ilimit=50 rail=0 Vos=0 phimargin=45 en=0 enk=0 in=0 ink=0 Rin=100000Meg  ; pins IN+ IN- V+ V- OUT
XU11 0 N010 Vcc Vee N011 level.2 Avol=1000Meg GBW=10000Meg Slew=1000Meg ilimit=50 rail=0 Vos=0 phimargin=45 en=0 enk=0 in=0 ink=0 Rin=100000Meg  ; pins IN+ IN- V+ V- OUT
XU12 0 N012 Vcc Vee N008 level.2 Avol=1000Meg GBW=10000Meg Slew=1000Meg ilimit=50 rail=0 Vos=0 phimargin=45 en=0 enk=0 in=0 ink=0 Rin=100000Meg  ; pins IN+ IN- V+ V- OUT
R25 N009 N007 {mc(2206.6k,tola)}
R26 N010 N009 {mc(3000,tola)}
R27 N012 N011 {mc(255.15k,tola)}
C7 N009 N007 {mc(1n,tolb)}
R28 N008 N007 {mc(255.15k,tola)}
R29 N011 N010 {mc(3000,tola)}
C8 N008 N012 {mc(1n,tolb)}
R30 N007 N013 {mc(3896.4k,tola)}
R31 N010 N013 {mc(5297.5,tola)}
R32 N012 N013 {mc(264.06k,tola)}
XU13 0 N001 Vcc Vee N003 level.2 Avol=1000Meg GBW=10000Meg Slew=1000Meg ilimit=50 rail=0 Vos=0 phimargin=45 en=0 enk=0 in=0 ink=0 Rin=100000Meg  ; pins IN+ IN- V+ V- OUT
XU14 0 N004 Vcc Vee V-out level.2 Avol=1000Meg GBW=10000Meg Slew=1000Meg ilimit=50 rail=0 Vos=0 phimargin=45 en=0 enk=0 in=0 ink=0 Rin=100000Meg  ; pins IN+ IN- V+ V- OUT
XU15 0 N005 Vcc Vee N002 level.2 Avol=1000Meg GBW=10000Meg Slew=1000Meg ilimit=50 rail=0 Vos=0 phimargin=45 en=0 enk=0 in=0 ink=0 Rin=100000Meg  ; pins IN+ IN- V+ V- OUT
R33 N003 N001 {mc(73.199k,tola)}
R34 N004 N003 {mc(3000,tola)}
R35 N005 V-out {mc(45.08k,tola)}
C9 N003 N001 {mc(1n,tolb)}
R36 N002 N001 {mc(45.08k,tola)}
R37 V-out N004 {mc(3000,tola)}
C10 N002 N005 {mc(1n,tolb)}
R38 N001 N006 {mc(56.917k,tola)}
R39 N004 N006 {mc(2332.7,tola)}
R40 N005 N006 {mc(119.13k,tola)}
XU16 N027 N032 N027 opamp Aol=100K GBW=10Meg  ; pins invin noninvin out
XU17 N020 N025 N020 opamp Aol=100K GBW=10Meg  ; pins invin noninvin out
XU18 N013 N018 N013 opamp Aol=100K GBW=10Meg  ; pins invin noninvin out
XU19 N006 N011 N006 opamp Aol=100K GBW=10Meg  ; pins invin noninvin out
.ac dec 1000 1 10e4
.step param run 1 100 1
.param tola=0.01
.param tolb=0.05
.lib opamp.sub
.lib UniversalOpamps2.sub
.backanno
.end